# EasyEDA schematic Web Radio Control morse key USB adapter.json
TITLE: Web Radio Control morse key USB adapter; REV: 1.0; Date: 2020-04-08; Sheet: 1/1; Drawn By: mikaelnousiainen; Company: Web Radio Control
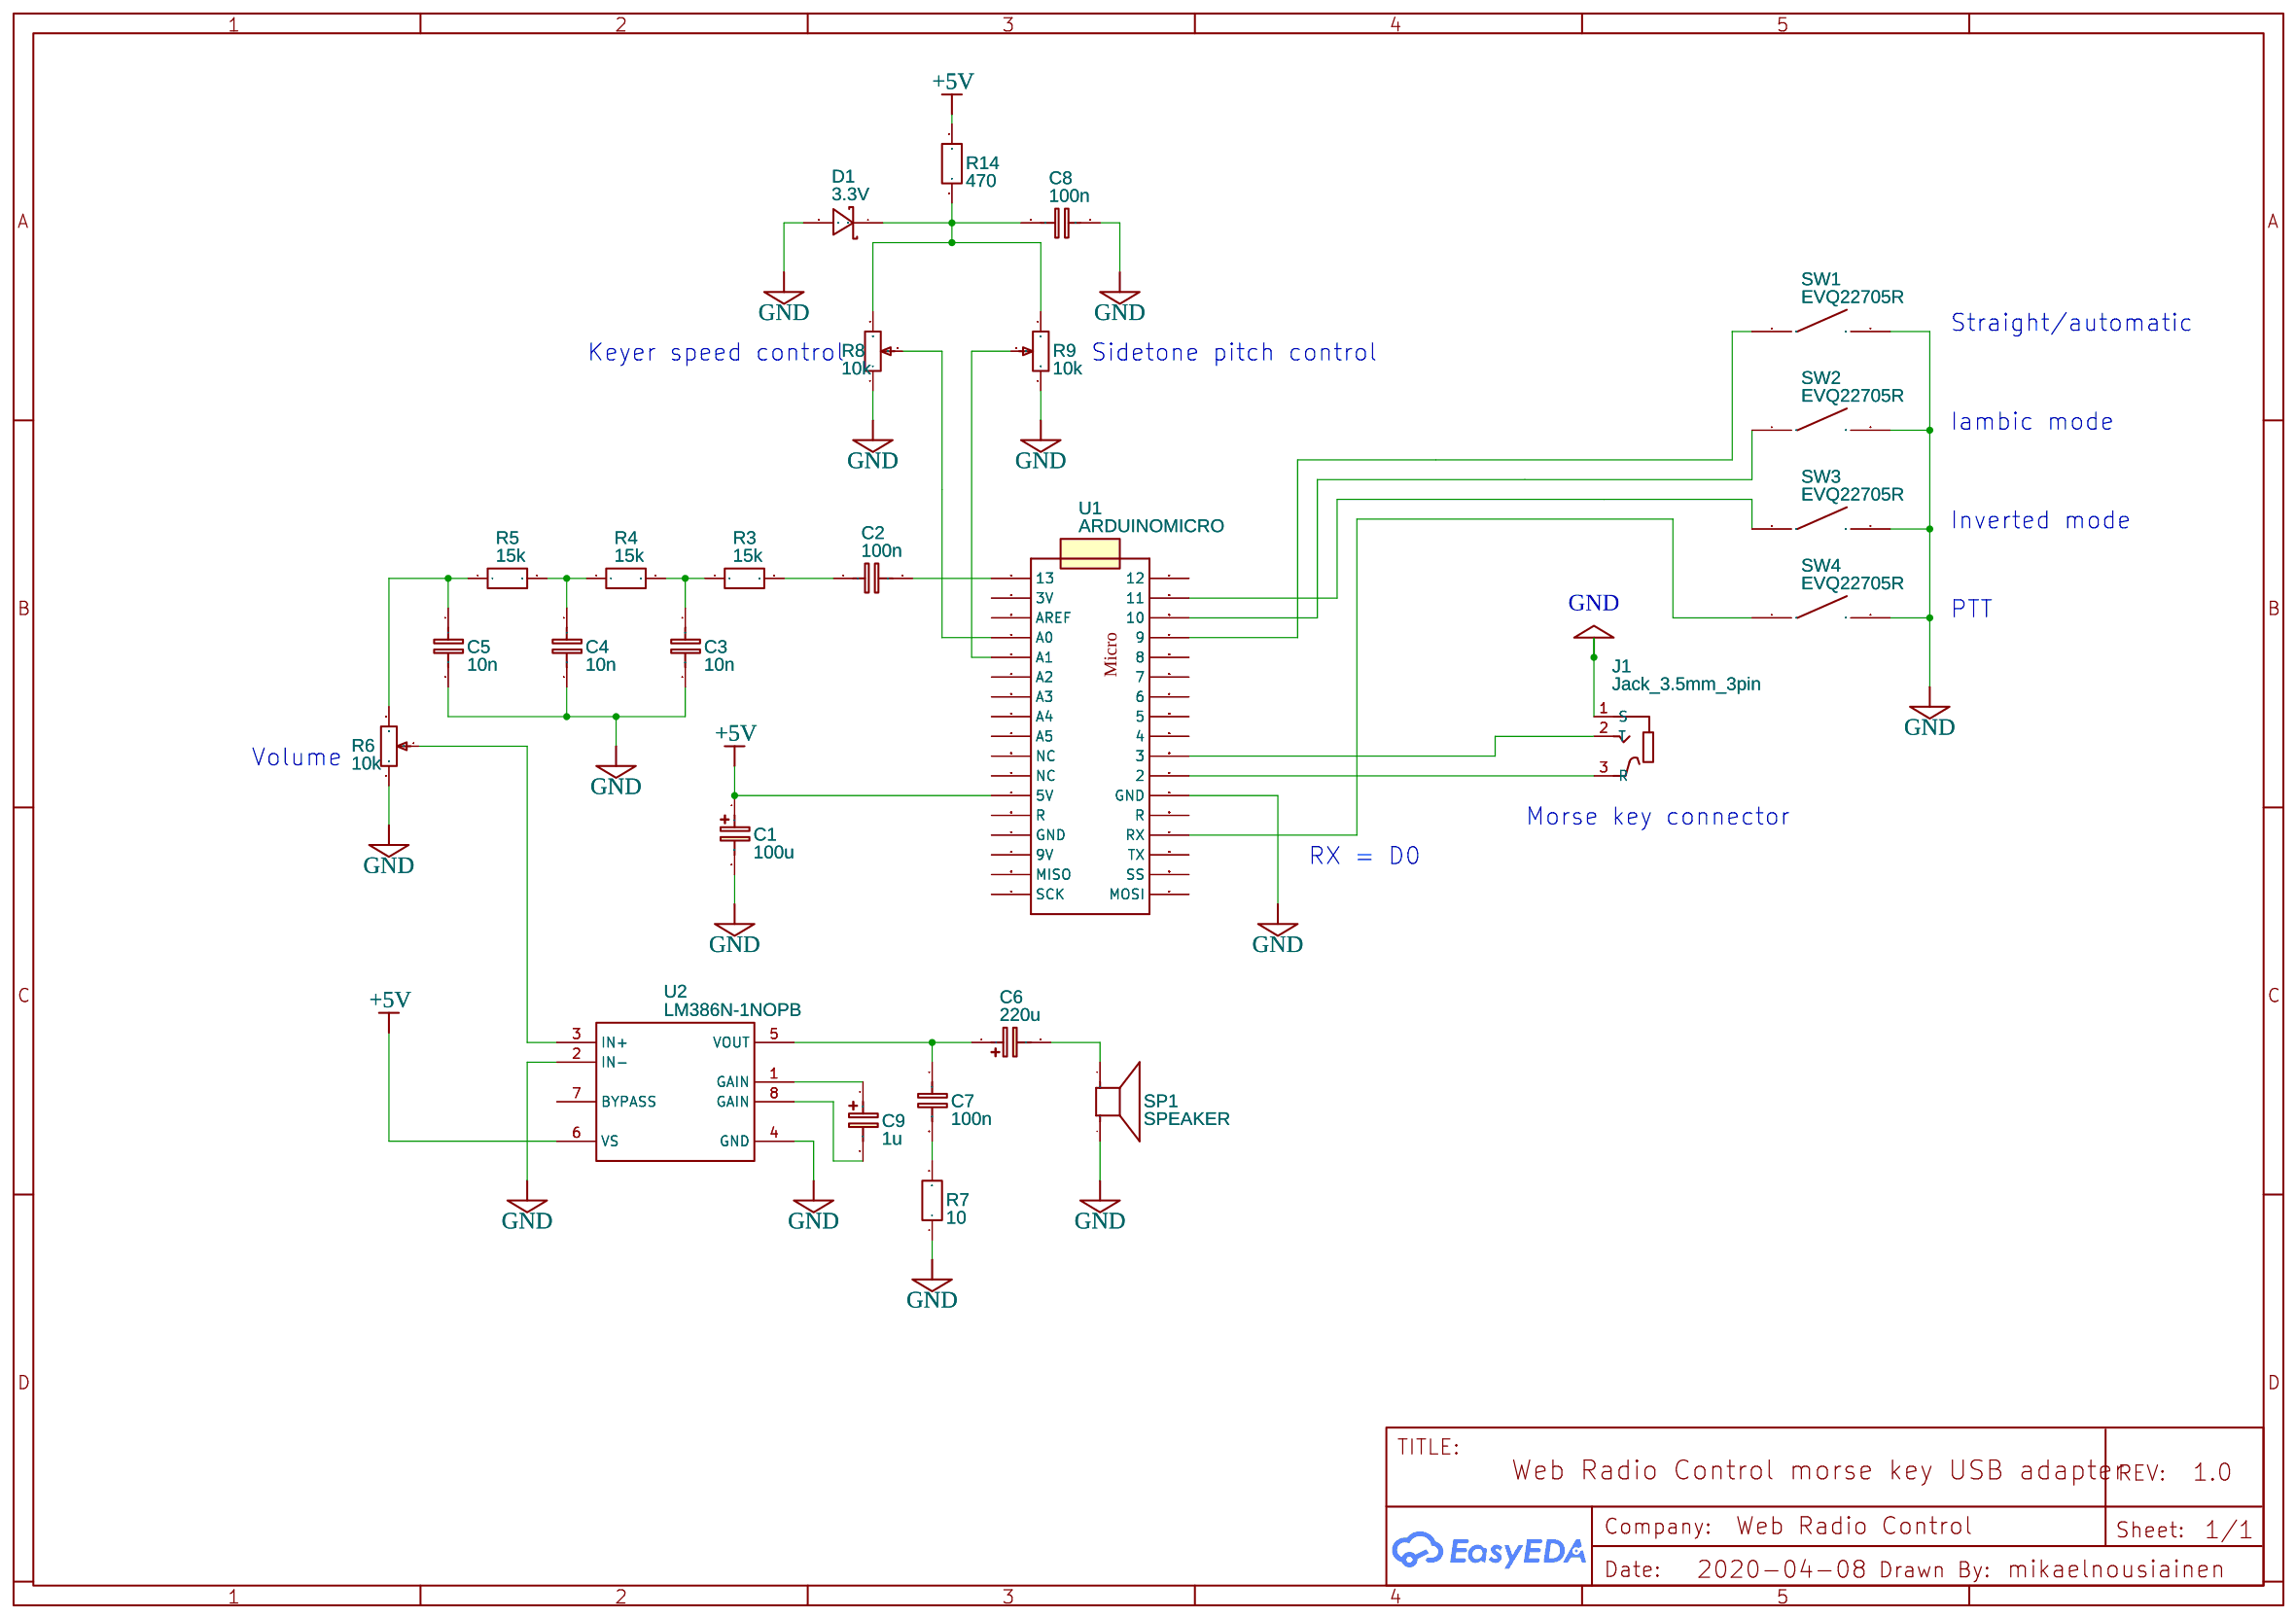
[diagram p0: schematic sheet]

## Parts
C1  100u  [CAP-D3.0XF1.5]
C2  100n  [RAD-0.1]
C3  10n  [RAD-0.1]
C4  10n  [RAD-0.1]
C5  10n  [RAD-0.1]
C6  220u  [CAP-D3.0XF1.5]
C7  100n  [RAD-0.1]
C8  100n  [RAD-0.1]
C9  1u  [CAP-D3.0XF1.5]
D1  3.3V  [SOD-123_L2.8-W1.8-LS3.7-RD]
J1  Jack_3.5mm_3pin
R3  15k  [AXIAL-0.3]
R4  15k  [AXIAL-0.3]
R5  15k  [AXIAL-0.3]
R6  10k  [RES-ADJ_3386P]
R7  10  [AXIAL-0.3]
R8  10k  [RES-ADJ_3386P]
R9  10k  [RES-ADJ_3386P]
R14  470  [AXIAL-0.3]
SP1  SPEAKER  [AL11P]
SW1  EVQ22705R  [KEY-6.0*6.0-4]
SW2  EVQ22705R  [KEY-6.0*6.0-4]
SW3  EVQ22705R  [KEY-6.0*6.0-4]
SW4  EVQ22705R  [KEY-6.0*6.0-4]
U1  ARDUINOMICRO  [ARDUINOMICRO]
U2  LM386N-1NOPB  [DIP8]

## Library data of the parts
C1 C6 C9 = Cap_Electrolytic(TH)_D3.0XF1.5_EU: Contributor: EasyEDA
C2-C5 C7 C8 = Cap_RAD-0.1_EU
D1 = MBR0520LT1G: Supplier: LCSC; Manufacturer: ON; image: //image.lceda.cn/szlcsc/C23848.jpg; Supplier Part: C23848; LCSC Assembly: Yes; SMT Type: Extend
J1 = Jack_3.5mm_3pin
R3-R5 R7 R14 = Res_AXIAL-0.3(1/8W)_EU
R6 R8 R9 = 3386P-1-101LF: Supplier: LCSC; Manufacturer: Bochen; Resistance(Ohms): 100; Supplier Part: C125022
SP1 = SPEAKER: Contributor: Adafruit
SW1-SW4 = EVQ22705R: Supplier: LCSC; Manufacturer: PANASONIC; Contributor: LCSC; Supplier Part: C79156
U1 = ARDUINOMICRO: Contributor: Adafruit
U2 = LM386N-1NOPB: Low Voltage Audio Power Amplifier, 8-pin MDIP, Pb-Free

## Nets
+5V: C1.1 R14.1 U1.P$23(5V) U2.6(VS)
GND: C1.2 C3.2 C4.2 C5.2 C8.1 D1.2(A) J1.1(S) R6.1 R7.1 R8.1 R9.3 SP1.- SW1.2 SW2.2 SW3.2 SW4.2 U1.P$21(GND) U2.2(IN-) U2.4(GND)
Net-(C2-1): C2.1 R3.2
Net-(C2-2): C2.2 U1.P$34(13)
Net-(C3-1): C3.1 R3.1 R4.2
Net-(C4-1): C4.1 R4.1 R5.2
Net-(C5-1): C5.1 R5.1 R6.3
Net-(C6-1): C6.1 C7.1 U2.5(VOUT)
Net-(C6-2): C6.2 SP1.+
Net-(C7-2): C7.2 R7.2
Net-(C8-2): C8.2 D1.1(C) R8.3 R9.1 R14.2
Net-(C9-1): C9.1 U2.1(GAIN)
Net-(C9-2): C9.2 U2.8(GAIN)
Net-(J1-2): J1.2(T) U1.P$10(3)
Net-(J1-3): J1.3(R) U1.P$11(2)
Net-(R6-2): R6.2 U2.3(IN+)
Net-(R8-2): R8.2 U1.P$31(A0)
Net-(R9-2): R9.2 U1.P$30(A1)
Net-(SW1-1): SW1.1 U1.P$4(9)
Net-(SW2-1): SW2.1 U1.P$3(10)
Net-(SW3-1): SW3.1 U1.P$2(11)
Net-(SW4-1): SW4.1 U1.P$14(RX)

Not connected (* = marked no-connect by the designer): U1 P$1(12) P$5(8) P$6(7) P$7(6) P$8(5) P$9(4) P$12(GND) P$13(R) P$15(TX) P$16(SS) P$17(MOSI) P$18(SCK) P$19(MISO) P$20(9V) P$22(R) P$24(NC) P$25(NC) P$26(A5) P$27(A4) P$28(A3) P$29(A2) P$32(AREF) P$33(3V); U2 7(BYPASS)

## Notes on the sheet
- Straight/automatic
- Keyer speed control
- Sidetone pitch control
- Iambic mode
- Inverted mode
- PTT
- Volume
- Morse key connector
- RX = D0
